# EAGLE schematic ou6_cs-ctrl V1.0 (EAGLE 7.6.0)
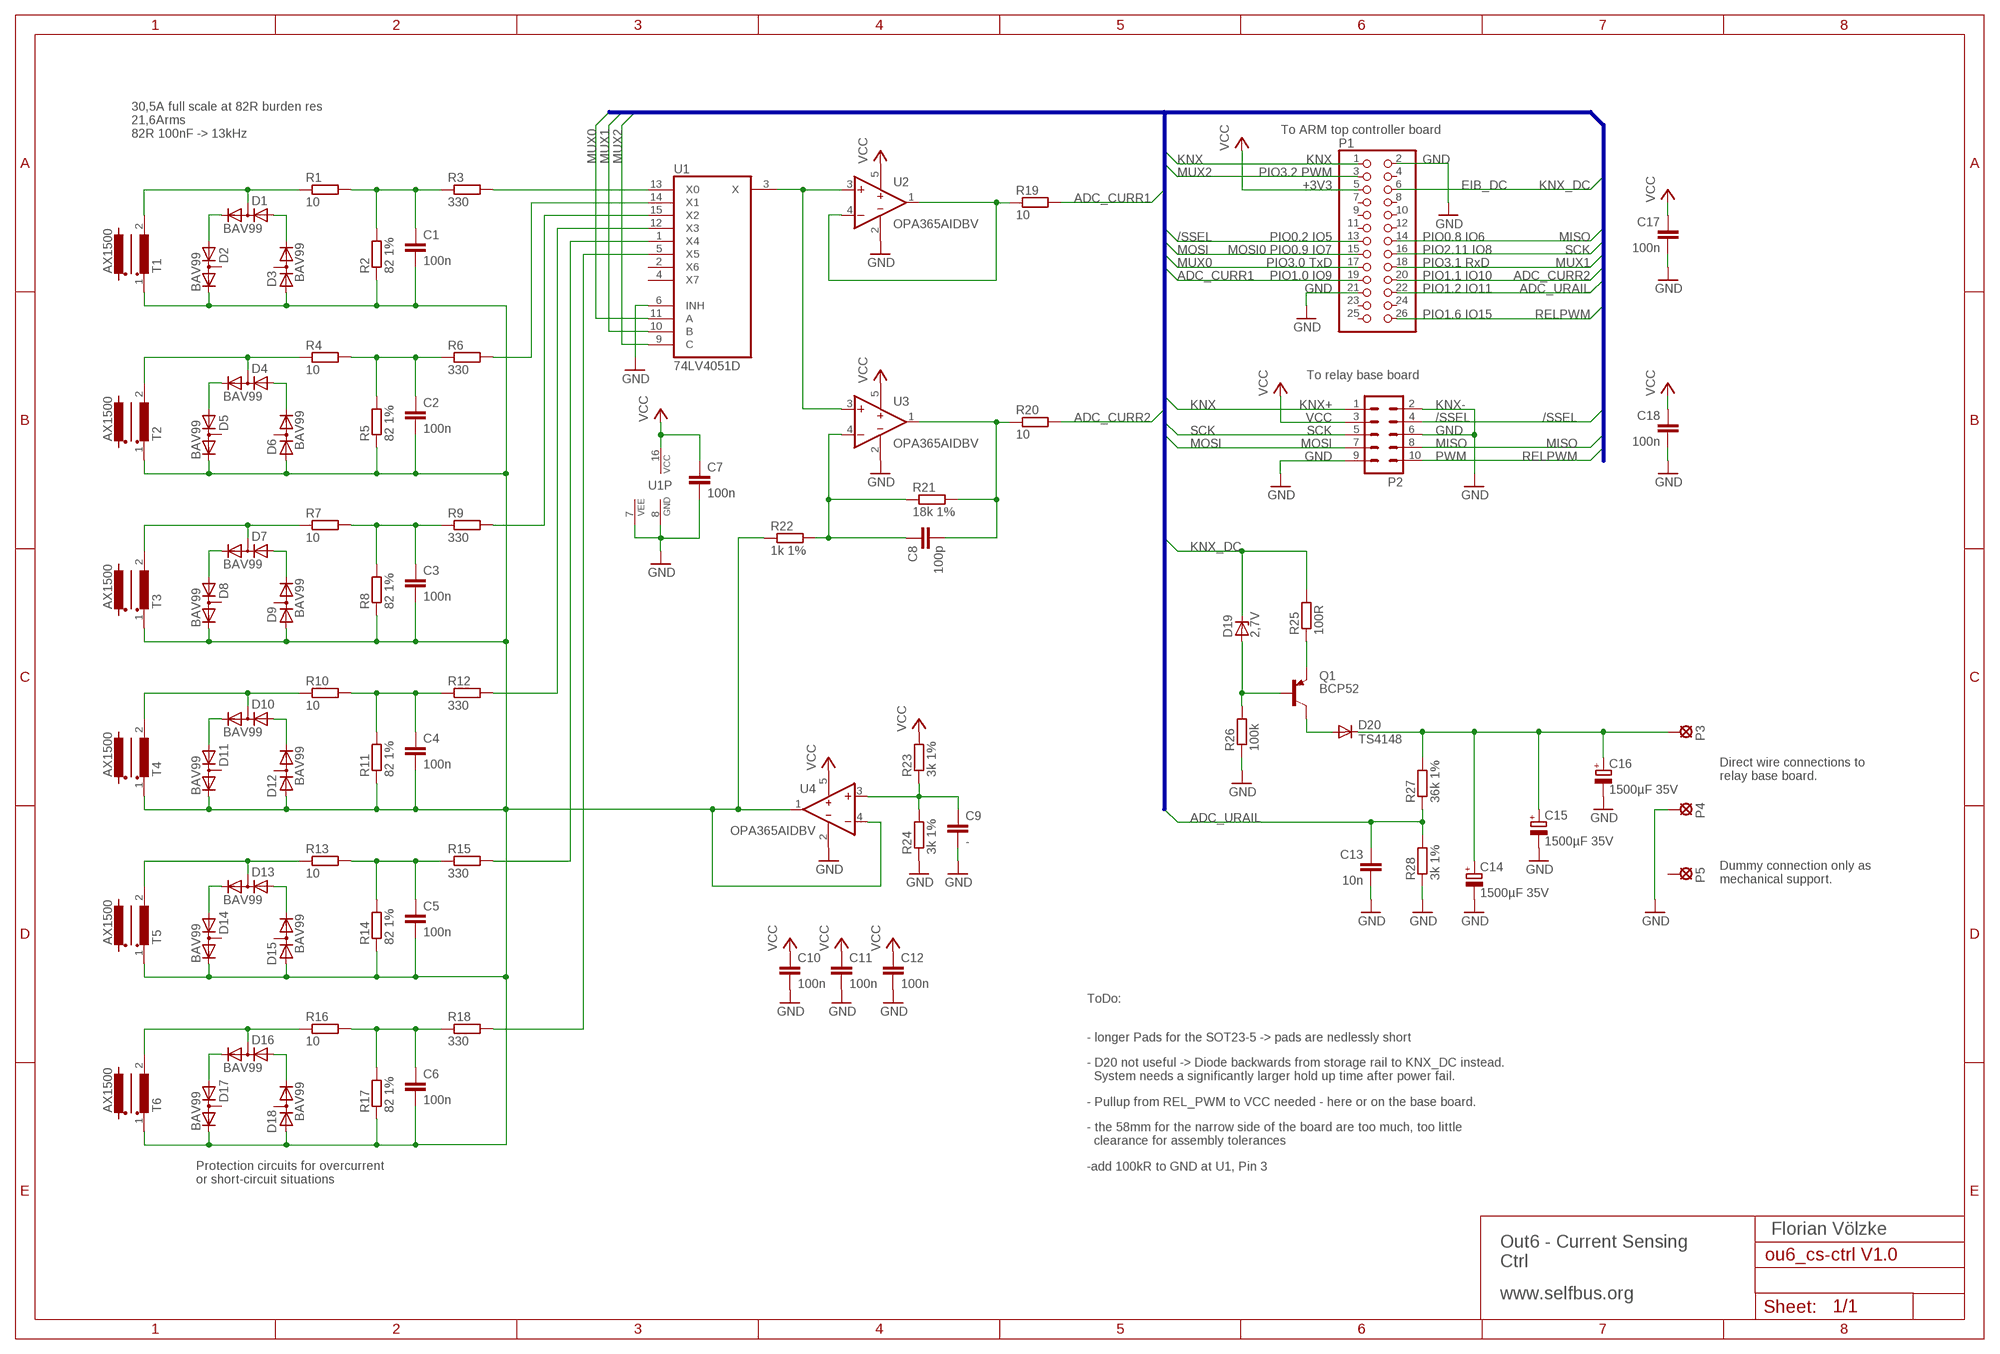
[diagram p0: schematic, sheet 1]

## Parts
C1  100n  C-EUC0805M  [R0805M]
C2  100n  C-EUC0805M  [R0805M]
C3  100n  C-EUC0805M  [R0805M]
C4  100n  C-EUC0805M  [R0805M]
C5  100n  C-EUC0805M  [R0805M]
C6  100n  C-EUC0805M  [R0805M]
C7  100n  C-EUC0805M  [R0805M]
C8  100p  C-EUC0805M  [R0805M]
C9  -  C-EUC0805M  [R0805M]
C10  100n  C-EUC0805M  [R0805M]
C11  100n  C-EUC0805M  [R0805M]
C12  100n  C-EUC0805M  [R0805M]
C13  10n  C-EUC0805M  [R0805M]
C14  1500µF 35V  CPOL-EUE5-13-30  [E5-13-30]
C15  1500µF 35V  CPOL-EUE5-13-30  [E5-13-30]
C16  1500µF 35V  CPOL-EUE5-13-30  [E5-13-30]
C17  100n  C-EUC0805M  [R0805M]
C18  100n  C-EUC0805M  [R0805M]
D1  BAV99  DIODE_2CACA-SOT23  [SOT23]
D2  BAV99  DIODE_2CACA-SOT23  [SOT23]
D3  BAV99  DIODE_2CACA-SOT23  [SOT23]
D4  BAV99  DIODE_2CACA-SOT23  [SOT23]
D5  BAV99  DIODE_2CACA-SOT23  [SOT23]
D6  BAV99  DIODE_2CACA-SOT23  [SOT23]
D7  BAV99  DIODE_2CACA-SOT23  [SOT23]
D8  BAV99  DIODE_2CACA-SOT23  [SOT23]
D9  BAV99  DIODE_2CACA-SOT23  [SOT23]
D10  BAV99  DIODE_2CACA-SOT23  [SOT23]
D11  BAV99  DIODE_2CACA-SOT23  [SOT23]
D12  BAV99  DIODE_2CACA-SOT23  [SOT23]
D13  BAV99  DIODE_2CACA-SOT23  [SOT23]
D14  BAV99  DIODE_2CACA-SOT23  [SOT23]
D15  BAV99  DIODE_2CACA-SOT23  [SOT23]
D16  BAV99  DIODE_2CACA-SOT23  [SOT23]
D17  BAV99  DIODE_2CACA-SOT23  [SOT23]
D18  BAV99  DIODE_2CACA-SOT23  [SOT23]
D19  2,7V  ZENER-DIODESOT23  [SOT23]
D20  TS4148  DIODE-MINIMELF  [MINIMELF]
P1  PINHD-2X13SMD  [2X13SMD]
P2  ML10  [ML10]
P3  SE1.5  [SE15]
P4  SE1.5  [SE15]
P5  SE1.5  [SE15]
Q1  BCP52  FZT753SMD  [SOT223]
R1  10  R-EU_R0805M  [R0805M]
R2  82 1%  R-EU_R0805M  [R0805M]
R3  330  R-EU_R0805M  [R0805M]
R4  10  R-EU_R0805M  [R0805M]
R5  82 1%  R-EU_R0805M  [R0805M]
R6  330  R-EU_R0805M  [R0805M]
R7  10  R-EU_R0805M  [R0805M]
R8  82 1%  R-EU_R0805M  [R0805M]
R9  330  R-EU_R0805M  [R0805M]
R10  10  R-EU_R0805M  [R0805M]
R11  82 1%  R-EU_R0805M  [R0805M]
R12  330  R-EU_R0805M  [R0805M]
R13  10  R-EU_R0805M  [R0805M]
R14  82 1%  R-EU_R0805M  [R0805M]
R15  330  R-EU_R0805M  [R0805M]
R16  10  R-EU_R0805M  [R0805M]
R17  82 1%  R-EU_R0805M  [R0805M]
R18  330  R-EU_R0805M  [R0805M]
R19  10  R-EU_R0805M  [R0805M]
R20  10  R-EU_R0805M  [R0805M]
R21  18k 1%  R-EU_R0805M  [R0805M]
R22  1k 1%  R-EU_R0805M  [R0805M]
R23  3k 1%  R-EU_R0805M  [R0805M]
R24  3k 1%  R-EU_R0805M  [R0805M]
R25  100R  R-EU_R0805M  [R0805M]
R26  100k  R-EU_R0805M  [R0805M]
R27  36k 1%  R-EU_R0805M  [R0805M]
R28  3k 1%  R-EU_R0805M  [R0805M]
T1  AX1500  STROMWANDLERTALEMA_AX1500  [SMALLXFORMER]
T2  AX1500  STROMWANDLERTALEMA_AX1500  [SMALLXFORMER]
T3  AX1500  STROMWANDLERTALEMA_AX1500  [SMALLXFORMER]
T4  AX1500  STROMWANDLERTALEMA_AX1500  [SMALLXFORMER]
T5  AX1500  STROMWANDLERTALEMA_AX1500  [SMALLXFORMER]
T6  AX1500  STROMWANDLERTALEMA_AX1500  [SMALLXFORMER]
U1  74LV4051D  4051D  [SO16]
U2  OPA365AIDBV  LTC2050CS5  [SOT23-5]
U3  OPA365AIDBV  LTC2050CS5  [SOT23-5]
U4  OPA365AIDBV  LTC2050CS5  [SOT23-5]

## Nets
/SSEL: P1.13 P2.4
ADC_CURR1: P1.19 R19.2
ADC_CURR2: P1.20 R20.2
ADC_URAIL: C13.1 P1.22 R27.1 R28.2
GND: C7.2 C9.2 C10.2 C11.2 C12.2 C13.2 C14.- C15.- C16.- C17.2 C18.2 P1.2 P1.21 P2.2 P2.6 P2.9 P4.MP R24.1 R26.1 R28.1 U1.6(INH) U1.7(VEE) U1.8(GND) U2.2(V-) U3.2(V-) U4.2(V-)
KNX: P1.1 P2.1
KNX_DC: D19.3(C) P1.6 R25.2
MISO: P1.14 P2.8
MOSI: P1.15 P2.7
MUX0: P1.17 U1.11(A)
MUX1: P1.18 U1.10(B)
MUX2: P1.3 U1.9(C)
N$1: R19.1 U2.1(OUT) U2.4(-IN)
N$2: D1.3(AC) R1.1 T1.2(W1E)
N$3: D1.2(C) D2.1(A)
N$4: D1.1(A) D3.2(C)
N$5: C1.1 R1.2 R2.2 R3.1
N$6: Q1.3(E) R25.1
N$7: D4.3(AC) R4.1 T2.2(W1E)
N$8: D4.2(C) D5.1(A)
N$9: D4.1(A) D6.2(C)
N$10: C2.1 R4.2 R5.2 R6.1
N$11: C8.2 R20.1 R21.2 U3.1(OUT)
N$12: D7.3(AC) R7.1 T3.2(W1E)
N$13: D7.2(C) D8.1(A)
N$14: D7.1(A) D9.2(C)
N$15: C3.1 R7.2 R8.2 R9.1
N$16: U1.3(X) U2.3(+IN) U3.3(+IN)
N$17: D10.3(AC) R10.1 T4.2(W1E)
N$18: D10.2(C) D11.1(A)
N$19: D10.1(A) D12.2(C)
N$20: C4.1 R10.2 R11.2 R12.1
N$21: C8.1 R21.1 R22.2 U3.4(-IN)
N$22: D13.3(AC) R13.1 T5.2(W1E)
N$23: D13.2(C) D14.1(A)
N$24: D13.1(A) D15.2(C)
N$25: C5.1 R13.2 R14.2 R15.1
N$26: C1.2 C2.2 C3.2 C4.2 C5.2 C6.2 D2.2(C) D3.1(A) D5.2(C) D6.1(A) D8.2(C) D9.1(A) D11.2(C) D12.1(A) D14.2(C) D15.1(A) D17.2(C) D18.1(A) R2.1 R5.1 R8.1 R11.1 R14.1 R17.1 R22.1 T1.1(W1A) T2.1(W1A) T3.1(W1A) T4.1(W1A) T5.1(W1A) T6.1(W1A) U4.1(OUT) U4.4(-IN)
N$27: D16.3(AC) R16.1 T6.2(W1E)
N$28: D16.2(C) D17.1(A)
N$29: D16.1(A) D18.2(C)
N$30: C6.1 R16.2 R17.2 R18.1
N$31: R3.2 U1.13(X0)
N$32: R6.2 U1.14(X1)
N$33: R9.2 U1.15(X2)
N$34: R12.2 U1.12(X3)
N$35: R15.2 U1.1(X4)
N$36: R18.2 U1.5(X5)
N$37: C9.1 R23.1 R24.2 U4.3(+IN)
N$38: D20.A Q1.2(C) Q1.4(C)
N$39: C14.+ C15.+ C16.+ D20.C P3.MP R27.2
N$41: D19.1(A) Q1.1(B) R26.2
RELPWM: P1.26 P2.10
SCK: P1.16 P2.5
VCC: C7.1 C10.1 C11.1 C12.1 C17.1 C18.1 P1.5 P2.3 R23.2 U1.16(VCC) U2.5(V+) U3.5(V+) U4.5(V+)
Unconnected: D2.3(AC) D3.3(AC) D5.3(AC) D6.3(AC) D8.3(AC) D9.3(AC) D11.3(AC) D12.3(AC) D14.3(AC) D15.3(AC) D17.3(AC) D18.3(AC) P1.4 P1.7 P1.8 P1.9 P1.10 P1.11 P1.12 P1.23 P1.24 P1.25 P5.MP U1.2(X6) U1.4(X7)

## Buses
MUX[0..2],ADC_CURR[1..2],ADC_URAIL,RELPWM,/SSEL,SCK,MOSI,MISO,KNX,KNX_DC

## Notes on the sheet
- To ARM top controller board
- 30,5A full scale at 82R burden res
  21,6Arms
  82R 100nF -> 13kHz
- KNX | GND
- PIO3.2 PWM
- +3V3 | EIB_DC
- PIO0.2 IO5 | PIO0.8 IO6
- MOSI0 PIO0.9 IO7 | PIO2.11 IO8
- PIO3.0 TxD | PIO3.1 RxD
- PIO1.0 IO9 | PIO1.1 IO10
- GND | PIO1.2 IO11
- PIO1.6 IO15
- To relay base board
- KNX+ | KNX-
- VCC | /SSEL
- SCK | GND
- MOSI | MISO
- GND | PWM
- Direct wire connections to
  relay base board.
- Dummy connection only as
  mechanical support.
- ToDo:
- - longer Pads for the SOT23-5 -> pads are nedlessly short
- - D20 not useful -> Diode backwards from storage rail to KNX_DC instead.
    System needs a significantly larger hold up time after power fail.
- - Pullup from REL_PWM to VCC needed - here or on the base board.
- - the 58mm for the narrow side of the board are too much, too little
    clearance for assembly tolerances
- -add 100kR to GND at U1, Pin 3
- Protection circuits for overcurrent
  or short-circuit situations
- Out6 - Current Sensing
  Ctrl
- Florian Völzke
- www.selfbus.org

## Library data of the parts
C1-C13 C17 C18 = rcl:C-EU: CAPACITOR, European symbol
C14-C16 = rcl:CPOL-EU: POLARIZED CAPACITOR, European symbol
D1-D18 = diode:DIODE_2CACA-: 2 Diodes - Cathode-Anode|Cathode-Anode
D19 = diode:ZENER-DIODE: Z-Diode
D20 = diode:DIODE-: DIODE
P1 = pinhead:PINHD-2X13: PIN HEADER
P2 = con-harting-ml:ML10: HARTING; OC_FARNELL: unknown; OC_NEWARK: unknown
P3-P5 = solpad:SE: SOLDER PAD drill in mm
Q1 = transistor-pnp:FZT753SMD: PNP Transistor
R1-R28 = rcl:R-EU_: RESISTOR, European symbol
T1-T6 = eigene:STROMWANDLER
U1 = 40xx:4051: 8-channel ANALOG MULTIPLEXER
U2-U4 = eigene:LTC2050